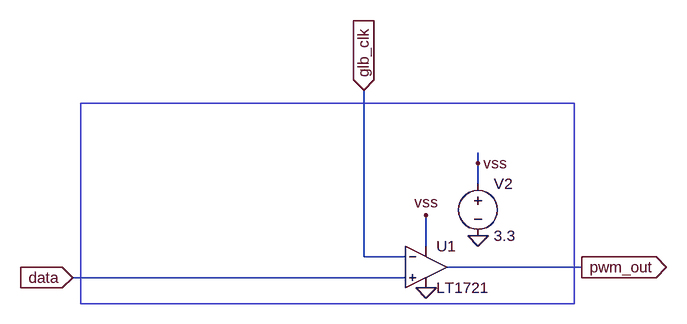
[diagram p0: schematic pwm_gen.asc]
pwm_gen.asc, the LTspice schematic file:
Version 4
SHEET 1 1140 680
WIRE 832 272 832 256
WIRE 832 304 832 272
WIRE 752 400 752 352
WIRE 656 416 656 160
WIRE 720 416 656 416
WIRE 992 432 784 432
WIRE 720 448 208 448
FLAG 752 464 0
FLAG 832 384 0
FLAG 832 272 vss
FLAG 752 352 vss
FLAG 992 432 pwm_out
IOPIN 992 432 Out
FLAG 208 448 data
IOPIN 208 448 In
FLAG 656 160 glb_clk
IOPIN 656 160 In
SYMBOL LT1721 752 368 R0
SYMATTR InstName U1
SYMBOL Voltage 832 288 R0
SYMATTR InstName V2
SYMATTR Value 3.3
RECTANGLE Normal 220 180 980 488

The netlist it stands for:
* pwm_gen.asc
XU1 data glb_clk vss 0 pwm_out LT1720  ; LT1721, pins In+ In- V+ V- OUT
V2 vss 0 3.3
.lib LTC.lib
.backanno
.end